# Altium project PC4-SODIMM_V200_RC_A1_20141015.PrjPcb (part 2 of 2)
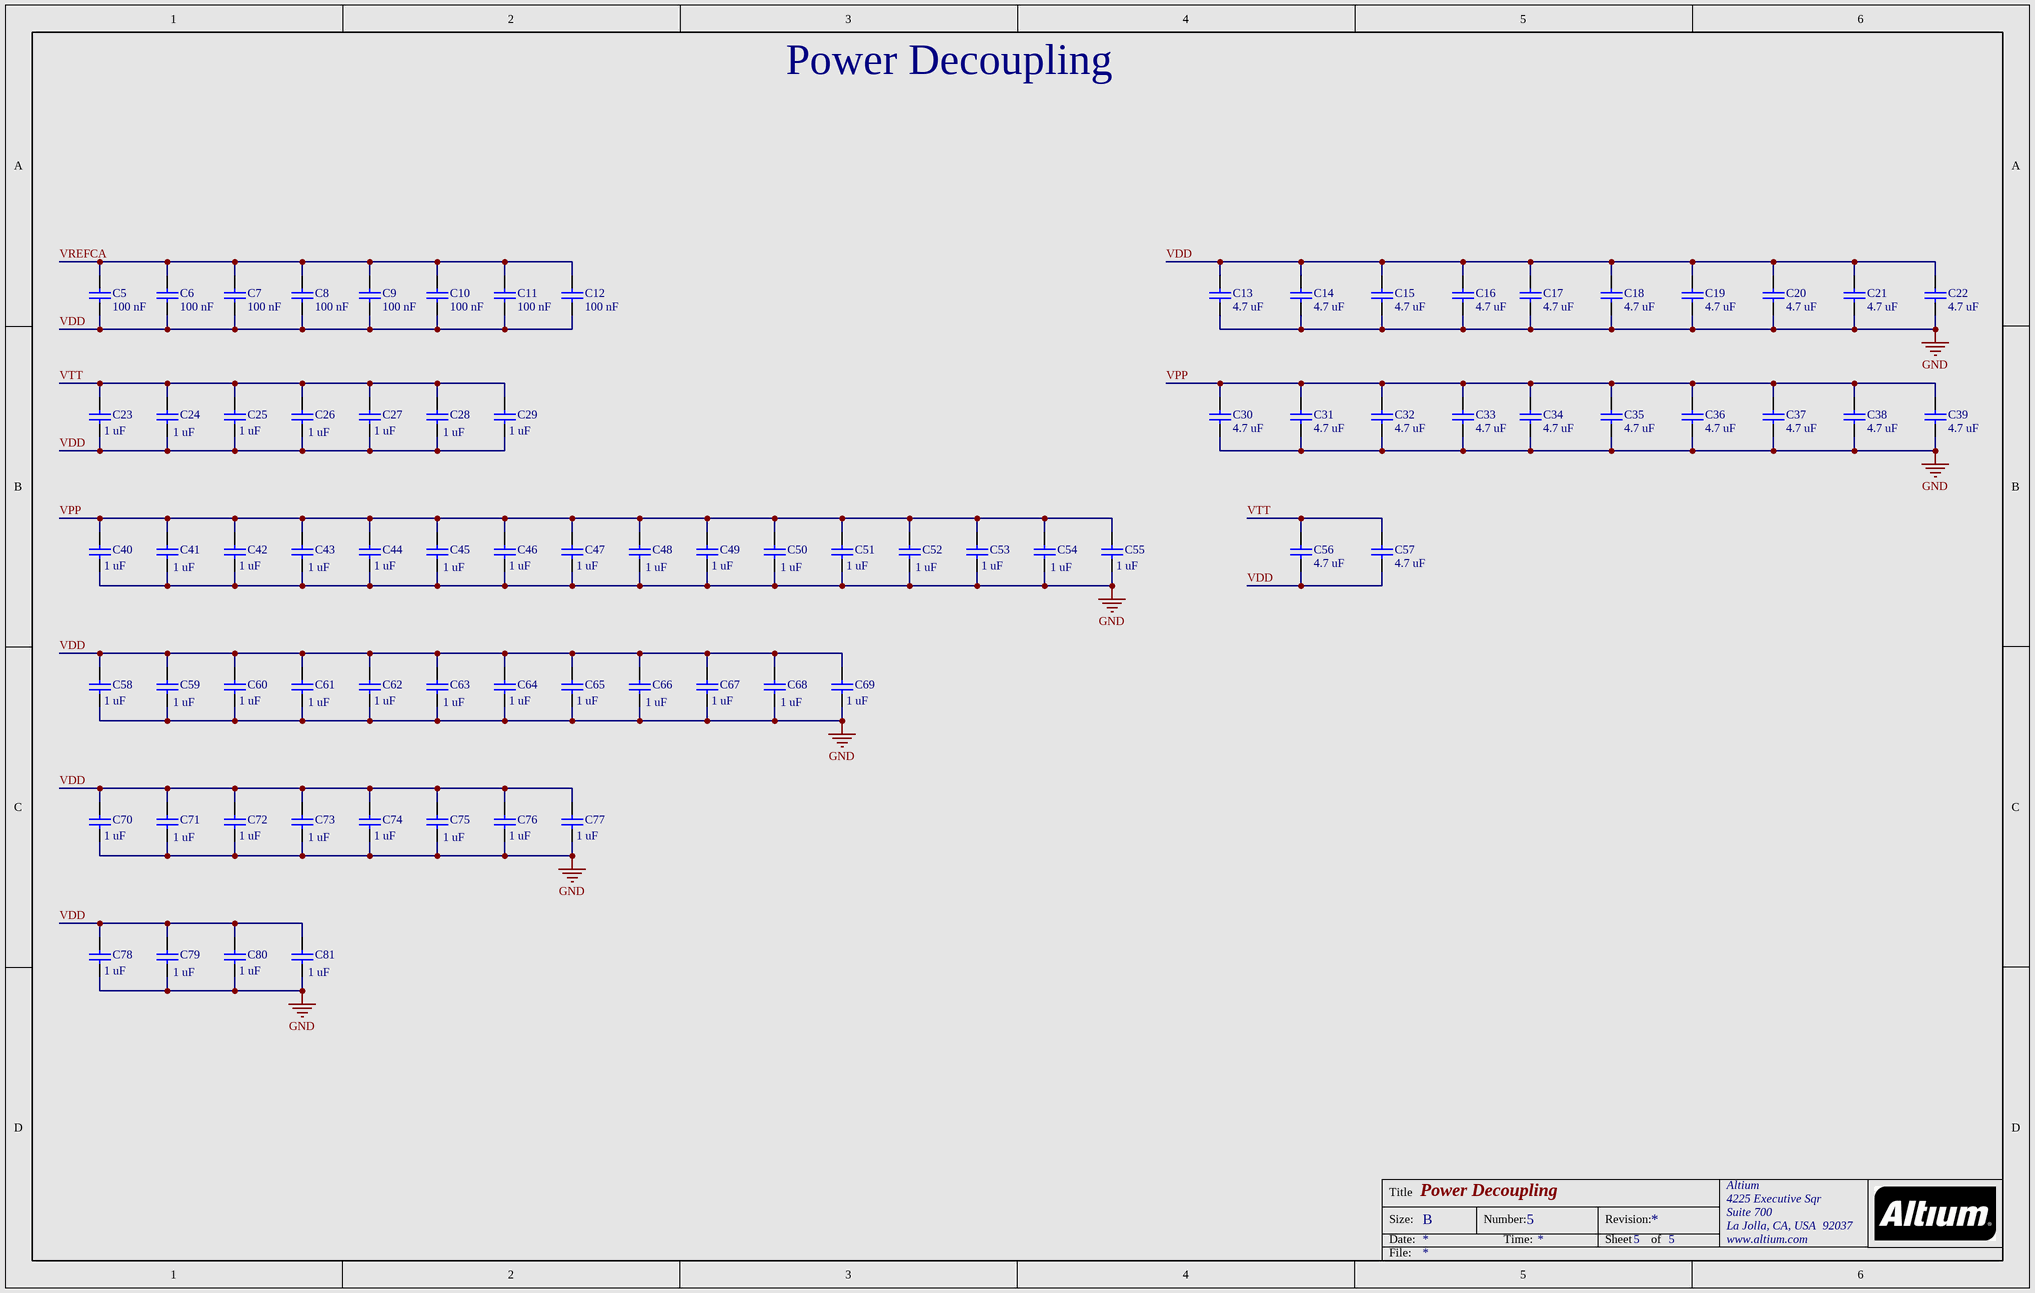
[diagram p5: Sheet5.SchDoc]

## Nets that join several sheets
GND: Sheet1 (98 pins), Sheet3 (60 pins), Sheet4 (60 pins), Sheet5 (60 pins)
A00: Sheet1 (X1.144), Sheet2 (RN5.3), Sheet3 (D2.L3 D3.L3 D4.L3 D5.L3), Sheet4 (U1.L3 U2.L3 U3.L3 U4.L3)
A01: Sheet1 (X1.133), Sheet2 (RN5.2), Sheet3 (D2.L7 D3.L7 D4.L7 D5.L7), Sheet4 (U1.L7 U2.L7 U3.L7 U4.L7)
A02: Sheet1 (X1.132), Sheet2 (RN7.1), Sheet3 (D2.M3 D3.M3 D4.M3 D5.M3), Sheet4 (U1.M3 U2.M3 U3.M3 U4.M3)
A03: Sheet1 (X1.131), Sheet2 (RN7.4), Sheet3 (D2.K7 D3.K7 D4.K7 D5.K7), Sheet4 (U1.K7 U2.K7 U3.K7 U4.K7)
A04: Sheet1 (X1.128), Sheet2 (RN5.1), Sheet3 (D2.K3 D3.K3 D4.K3 D5.K3), Sheet4 (U1.K3 U2.K3 U3.K3 U4.K3)
A05: Sheet1 (X1.126), Sheet2 (RN7.2), Sheet3 (D2.L8 D3.L8 D4.L8 D5.L8), Sheet4 (U1.L8 U2.L8 U3.L8 U4.L8)
A06: Sheet1 (X1.127), Sheet2 (RN2.4), Sheet3 (D2.L2 D3.L2 D4.L2 D5.L2), Sheet4 (U1.L2 U2.L2 U3.L2 U4.L2)
A07: Sheet1 (X1.122), Sheet2 (RN7.3), Sheet3 (D2.M8 D3.M8 D4.M8 D5.M8), Sheet4 (U1.M8 U2.M8 U3.M8 U4.M8)
A08: Sheet1 (X1.125), Sheet2 (RN5.4), Sheet3 (D2.M2 D3.M2 D4.M2 D5.M2), Sheet4 (U1.M2 U2.M2 U3.M2 U4.M2)
A09: Sheet1 (X1.121), Sheet2 (RN6.1), Sheet3 (D2.M7 D3.M7 D4.M7 D5.M7), Sheet4 (U1.M7 U2.M7 U3.M7 U4.M7)
A10: Sheet1 (X1.146), Sheet2 (RN3.1), Sheet3 (D2.J3 D3.J3 D4.J3 D5.J3), Sheet4 (U1.J3 U2.J3 U3.J3 U4.J3)
A11: Sheet1 (X1.120), Sheet2 (RN6.4), Sheet3 (D2.N2 D3.N2 D4.N2 D5.N2), Sheet4 (U1.N2 U2.N2 U3.N2 U4.N2)
A12: Sheet1 (X1.119), Sheet2 (RN4.3), Sheet3 (D2.J7 D3.J7 D4.J7 D5.J7), Sheet4 (U1.J7 U2.J7 U3.J7 U4.J7)
A13: Sheet1 (X1.158), Sheet2 (RN6.3), Sheet3 (D2.N8 D3.N8 D4.N8 D5.N8), Sheet4 (U1.N8 U2.N8 U3.N8 U4.N8)
A14: Sheet1 (X1.151), Sheet2 (RN2.3), Sheet3 (D2.H2 D3.H2 D4.H2 D5.H2), Sheet4 (U1.H2 U2.H2 U3.H2 U4.H2)
A15: Sheet1 (X1.156), Sheet2 (RN3.4), Sheet3 (D2.H7 D3.H7 D4.H7 D5.H7), Sheet4 (U1.H7 U2.H7 U3.H7 U4.H7)
A16: Sheet1 (X1.152), Sheet2 (RN4.2), Sheet3 (D2.H8 D3.H8 D4.H8 D5.H8), Sheet4 (U1.H8 U2.H8 U3.H8 U4.H8)
ACT: Sheet1 (X1.114), Sheet2 (RN3.3), Sheet3 (D2.H3 D3.H3 D4.H3 D5.H3), Sheet4 (U1.H3 U2.H3 U3.H3 U4.H3)
ALERT: Sheet1 (R2.1 X1.116), Sheet3 (D2.L9 D3.L9 D4.L9 D5.L9), Sheet4 (U1.L9 U2.L9 U3.L9 U4.L9)
BA0: Sheet1 (X1.150), Sheet2 (RN2.2), Sheet3 (D2.K2 D3.K2 D4.K2 D5.K2), Sheet4 (U1.K2 U2.K2 U3.K2 U4.K2)
BA1: Sheet1 (X1.145), Sheet2 (RN4.1), Sheet3 (D2.K8 D3.K8 D4.K8 D5.K8), Sheet4 (U1.K8 U2.K8 U3.K8 U4.K8)
BG0: Sheet1 (X1.115), Sheet2 (RN3.2), Sheet3 (D2.J2 D3.J2 D4.J2 D5.J2), Sheet4 (U1.J2 U2.J2 U3.J2 U4.J2)
BG1: Sheet1 (X1.113), Sheet2 (RN2.1), Sheet3 (D2.J8 D3.J8 D4.J8 D5.J8), Sheet4 (U1.J8 U2.J8 U3.J8 U4.J8)
CK0_N: Sheet1 (C3.2 X1.139), Sheet2 (R85.1), Sheet3 (D2.F8 D3.F8 D4.F8 D5.F8), Sheet4 (U1.F8 U2.F8 U3.F8 U4.F8)
CK0_P: Sheet1 (C3.1 X1.137), Sheet2 (R80.1), Sheet3 (D2.F7 D3.F7 D4.F7 D5.F7), Sheet4 (U1.F7 U2.F7 U3.F7 U4.F7)
CKE0: Sheet1 (X1.109), Sheet2 (RN1.4), Sheet3 (D2.G3 D3.G3 D4.G3 D5.G3), Sheet4 (U1.G3 U2.G3 U3.G3 U4.G3)
DM0: Sheet1 (X1.12), Sheet2 (R36.1)
DM0R: Sheet2 (R36.2), Sheet3 (D2.A7)
DM1: Sheet1 (X1.33), Sheet2 (R56.1)
DM1R: Sheet2 (R56.2), Sheet3 (D3.A7)
DM2: Sheet1 (X1.54), Sheet2 (R37.1)
DM2R: Sheet2 (R37.2), Sheet3 (D4.A7)
DM3: Sheet1 (X1.75), Sheet2 (R57.1)
DM3R: Sheet2 (R57.2), Sheet3 (D5.A7)
DM4: Sheet1 (X1.178), Sheet2 (R38.1)
DM4R: Sheet2 (R38.2), Sheet4 (U1.A7)
DM5: Sheet1 (X1.199), Sheet2 (R58.1)
DM5R: Sheet2 (R58.2), Sheet4 (U2.A7)
DM6: Sheet1 (X1.220), Sheet2 (R39.1)
DM6R: Sheet2 (R39.2), Sheet4 (U3.A7)
DM7: Sheet1 (X1.241), Sheet2 (R59.1)
DM7R: Sheet2 (R59.2), Sheet4 (U4.A7)
DQ00: Sheet1 (X1.8), Sheet2 (R32.1)
DQ00R: Sheet2 (R32.2), Sheet3 (D2.B7)
DQ01: Sheet1 (X1.7), Sheet2 (R8.1)
DQ01R: Sheet2 (R8.2), Sheet3 (D2.D7)
DQ02: Sheet1 (X1.20), Sheet2 (R44.1)
DQ02R: Sheet2 (R44.2), Sheet3 (D2.D3)
DQ03: Sheet1 (X1.21), Sheet2 (R24.1)
DQ03R: Sheet2 (R24.2), Sheet3 (D2.C2)
DQ04: Sheet1 (X1.4), Sheet2 (R28.1)
DQ04R: Sheet2 (R28.2), Sheet3 (D2.D8)
DQ05: Sheet1 (X1.3), Sheet2 (R4.1)
DQ05R: Sheet2 (R4.2), Sheet3 (D2.E7)
DQ06: Sheet1 (X1.16), Sheet2 (R40.1)
DQ06R: Sheet2 (R40.2), Sheet3 (D2.D2)
DQ07: Sheet1 (X1.17), Sheet2 (R20.1)
DQ07R: Sheet2 (R20.2), Sheet3 (D2.E3)
DQ08: Sheet1 (X1.28), Sheet2 (R72.1)
DQ08R: Sheet2 (R72.2), Sheet3 (D3.E3)
DQ09: Sheet1 (X1.29), Sheet2 (R52.1)
DQ09R: Sheet2 (R52.2), Sheet3 (D3.D2)
DQ10: Sheet1 (X1.41), Sheet2 (R64.1)
DQ10R: Sheet2 (R64.2), Sheet3 (D3.D8)
DQ11: Sheet1 (X1.42), Sheet2 (R90.1)
DQ11R: Sheet2 (R90.2), Sheet3 (D3.E7)
DQ12: Sheet1 (X1.24), Sheet2 (R68.1)
DQ12R: Sheet2 (R68.2), Sheet3 (D3.C2)
DQ13: Sheet1 (X1.25), Sheet2 (R48.1)
DQ13R: Sheet2 (R48.2), Sheet3 (D3.D3)
DQ14: Sheet1 (X1.38), Sheet2 (R86.1)
DQ14R: Sheet2 (R86.2), Sheet3 (D3.D7)
DQ15: Sheet1 (X1.37), Sheet2 (R60.1)
DQ15R: Sheet2 (R60.2), Sheet3 (D3.B7)
DQ16: Sheet1 (X1.50), Sheet2 (R33.1)
DQ16R: Sheet2 (R33.2), Sheet3 (D4.D7)
DQ17: Sheet1 (X1.49), Sheet2 (R9.1)
DQ17R: Sheet2 (R9.2), Sheet3 (D4.B7)
DQ18: Sheet1 (X1.62), Sheet2 (R45.1)
DQ18R: Sheet2 (R45.2), Sheet3 (D4.D3)
DQ19: Sheet1 (X1.63), Sheet2 (R25.1)
DQ19R: Sheet2 (R25.2), Sheet3 (D4.C2)
DQ20: Sheet1 (X1.46), Sheet2 (R29.1)
DQ20R: Sheet2 (R29.2), Sheet3 (D4.E7)
DQ21: Sheet1 (X1.45), Sheet2 (R5.1)
DQ21R: Sheet2 (R5.2), Sheet3 (D4.D8)
DQ22: Sheet1 (X1.58), Sheet2 (R41.1)
DQ22R: Sheet2 (R41.2), Sheet3 (D4.D2)
DQ23: Sheet1 (X1.59), Sheet2 (R21.1)
DQ23R: Sheet2 (R21.2), Sheet3 (D4.E3)
DQ24: Sheet1 (X1.70), Sheet2 (R73.1)
DQ24R: Sheet2 (R73.2), Sheet3 (D5.D2)
DQ25: Sheet1 (X1.71), Sheet2 (R53.1)
DQ25R: Sheet2 (R53.2), Sheet3 (D5.E3)
DQ26: Sheet1 (X1.83), Sheet2 (R65.1)
DQ26R: Sheet2 (R65.2), Sheet3 (D5.D8)
DQ27: Sheet1 (X1.84), Sheet2 (R91.1)
DQ27R: Sheet2 (R91.2), Sheet3 (D5.E7)
DQ28: Sheet1 (X1.66), Sheet2 (R69.1)
DQ28R: Sheet2 (R69.2), Sheet3 (D5.D3)
DQ29: Sheet1 (X1.67), Sheet2 (R49.1)
DQ29R: Sheet2 (R49.2), Sheet3 (D5.C2)
DQ30: Sheet1 (X1.79), Sheet2 (R61.1)
DQ30R: Sheet2 (R61.2), Sheet3 (D5.B7)
DQ31: Sheet1 (X1.80), Sheet2 (R87.1)
DQ31R: Sheet2 (R87.2), Sheet3 (D5.D7)
DQ32: Sheet1 (X1.174), Sheet2 (R34.1)
DQ32R: Sheet2 (R34.2), Sheet4 (U1.D8)
DQ33: Sheet1 (X1.173), Sheet2 (R10.1)
DQ33R: Sheet2 (R10.2), Sheet4 (U1.E7)
DQ34: Sheet1 (X1.187), Sheet2 (R26.1)
DQ34R: Sheet2 (R26.2), Sheet4 (U1.E3)
DQ35: Sheet1 (X1.186), Sheet2 (R46.1)
DQ35R: Sheet2 (R46.2), Sheet4 (U1.D2)
DQ36: Sheet1 (X1.170), Sheet2 (R30.1)
DQ36R: Sheet2 (R30.2), Sheet4 (U1.B7)
DQ37: Sheet1 (X1.169), Sheet2 (R6.1)
DQ37R: Sheet2 (R6.2), Sheet4 (U1.D7)
DQ38: Sheet1 (X1.183), Sheet2 (R22.1)
DQ38R: Sheet2 (R22.2), Sheet4 (U1.C2)
DQ39: Sheet1 (X1.182), Sheet2 (R42.1)
DQ39R: Sheet2 (R42.2), Sheet4 (U1.D3)
DQ40: Sheet1 (X1.195), Sheet2 (R54.1)
DQ40R: Sheet2 (R54.2), Sheet4 (U2.C2)
DQ41: Sheet1 (X1.194), Sheet2 (R74.1)
DQ41R: Sheet2 (R74.2), Sheet4 (U2.D3)
DQ42: Sheet1 (X1.207), Sheet2 (R66.1)
DQ42R: Sheet2 (R66.2), Sheet4 (U2.B7)
DQ43: Sheet1 (X1.208), Sheet2 (R92.1)
DQ43R: Sheet2 (R92.2), Sheet4 (U2.D7)
DQ44: Sheet1 (X1.191), Sheet2 (R50.1)
DQ44R: Sheet2 (R50.2), Sheet4 (U2.D2)
DQ45: Sheet1 (X1.190), Sheet2 (R70.1)
DQ45R: Sheet2 (R70.2), Sheet4 (U2.E3)
DQ46: Sheet1 (X1.203), Sheet2 (R62.1)
DQ46R: Sheet2 (R62.2), Sheet4 (U2.E7)
DQ47: Sheet1 (X1.204), Sheet2 (R88.1)
DQ47R: Sheet2 (R88.2), Sheet4 (U2.D8)
DQ48: Sheet1 (X1.216), Sheet2 (R35.1)
DQ48R: Sheet2 (R35.2), Sheet4 (U3.E7)
DQ49: Sheet1 (X1.215), Sheet2 (R11.1)
DQ49R: Sheet2 (R11.2), Sheet4 (U3.D8)
DQ50: Sheet1 (X1.228), Sheet2 (R47.1)
DQ50R: Sheet2 (R47.2), Sheet4 (U3.D2)
DQ51: Sheet1 (X1.229), Sheet2 (R27.1)
DQ51R: Sheet2 (R27.2), Sheet4 (U3.E3)
DQ52: Sheet1 (X1.211), Sheet2 (R7.1)
DQ52R: Sheet2 (R7.2), Sheet4 (U3.B7)
DQ53: Sheet1 (X1.212), Sheet2 (R31.1)
DQ53R: Sheet2 (R31.2), Sheet4 (U3.D7)
DQ54: Sheet1 (X1.224), Sheet2 (R43.1)
DQ54R: Sheet2 (R43.2), Sheet4 (U3.D3)
DQ55: Sheet1 (X1.225), Sheet2 (R23.1)
DQ55R: Sheet2 (R23.2), Sheet4 (U3.C2)
DQ56: Sheet1 (X1.237), Sheet2 (R55.1)
DQ56R: Sheet2 (R55.2), Sheet4 (U4.C2)
DQ57: Sheet1 (X1.236), Sheet2 (R75.1)
DQ57R: Sheet2 (R75.2), Sheet4 (U4.D3)
DQ58: Sheet1 (X1.249), Sheet2 (R67.1)
DQ58R: Sheet2 (R67.2), Sheet4 (U4.B7)
DQ59: Sheet1 (X1.250), Sheet2 (R93.1)
DQ59R: Sheet2 (R93.2), Sheet4 (U4.D7)
DQ60: Sheet1 (X1.232), Sheet2 (R71.1)
DQ60R: Sheet2 (R71.2), Sheet4 (U4.E3)
DQ61: Sheet1 (X1.233), Sheet2 (R51.1)
DQ61R: Sheet2 (R51.2), Sheet4 (U4.D2)
DQ62: Sheet1 (X1.245), Sheet2 (R63.1)
DQ62R: Sheet2 (R63.2), Sheet4 (U4.D8)
DQ63: Sheet1 (X1.246), Sheet2 (R89.1)
DQ63R: Sheet2 (R89.2), Sheet4 (U4.E7)
DQS0_N: Sheet1 (X1.11), Sheet2 (R12.1)
DQS0_P: Sheet1 (X1.13), Sheet2 (R16.1)
DQS0R_N: Sheet2 (R12.2), Sheet3 (D2.B3)
DQS0R_P: Sheet2 (R16.2), Sheet3 (D2.C3)
DQS1_N: Sheet1 (X1.32), Sheet2 (R76.1)
DQS1_P: Sheet1 (X1.34), Sheet2 (R81.1)
DQS1R_N: Sheet2 (R76.2), Sheet3 (D3.B3)
DQS1R_P: Sheet2 (R81.2), Sheet3 (D3.C3)
DQS2_N: Sheet1 (X1.53), Sheet2 (R13.1)
DQS2_P: Sheet1 (X1.55), Sheet2 (R17.1)
DQS2R_N: Sheet2 (R13.2), Sheet3 (D4.B3)
DQS2R_P: Sheet2 (R17.2), Sheet3 (D4.C3)
DQS3_N: Sheet1 (X1.74), Sheet2 (R77.1)
DQS3_P: Sheet1 (X1.76), Sheet2 (R82.1)
DQS3R_N: Sheet2 (R77.2), Sheet3 (D5.B3)
DQS3R_P: Sheet2 (R82.2), Sheet3 (D5.C3)
DQS4_N: Sheet1 (X1.177), Sheet2 (R14.1)
DQS4_P: Sheet1 (X1.179), Sheet2 (R18.1)
DQS4R_N: Sheet2 (R14.2), Sheet4 (U1.B3)
DQS4R_P: Sheet2 (R18.2), Sheet4 (U1.C3)
DQS5_N: Sheet1 (X1.198), Sheet2 (R78.1)
DQS5_P: Sheet1 (X1.200), Sheet2 (R83.1)
DQS5R_N: Sheet2 (R78.2), Sheet4 (U2.B3)
DQS5R_P: Sheet2 (R83.2), Sheet4 (U2.C3)
DQS6_N: Sheet1 (X1.219), Sheet2 (R15.1)
DQS6_P: Sheet1 (X1.221), Sheet2 (R19.1)
DQS6R_N: Sheet2 (R15.2), Sheet4 (U3.B3)
DQS6R_P: Sheet2 (R19.2), Sheet4 (U3.C3)
DQS7_N: Sheet1 (X1.240), Sheet2 (R79.1)
DQS7_P: Sheet1 (X1.242), Sheet2 (R84.1)
DQS7R_N: Sheet2 (R79.2), Sheet4 (U4.B3)
DQS7R_P: Sheet2 (R84.2), Sheet4 (U4.C3)
MEMRST: Sheet1 (C1.1 R1.2), Sheet3 (D2.L1 D3.L1 D4.L1 D5.L1), Sheet4 (U1.L1 U2.L1 U3.L1 U4.L1)
ODT0: Sheet1 (X1.155), Sheet2 (RN1.2), Sheet3 (D2.F3 D3.F3 D4.F3 D5.F3), Sheet4 (U1.F3 U2.F3 U3.F3 U4.F3)
PARITY: Sheet1 (X1.143), Sheet2 (RN6.2), Sheet3 (D2.N3 D3.N3 D4.N3 D5.N3), Sheet4 (U1.N3 U2.N3 U3.N3 U4.N3)
S0: Sheet1 (X1.149), Sheet2 (RN1.1), Sheet3 (D2.G7 D3.G7 D4.G7 D5.G7), Sheet4 (U1.G7 U2.G7 U3.G7 U4.G7)
VDD: Sheet1 (20 pins), Sheet2 (C4.2), Sheet3 (56 pins), Sheet4 (56 pins), Sheet5 (51 pins)
VPP: Sheet1 (X1.257 X1.259), Sheet3 (8 pins), Sheet4 (8 pins), Sheet5 (26 pins)
VREFCA: Sheet1 (X1.164), Sheet3 (D2.J1 D3.J1 D4.J1 D5.J1), Sheet4 (U1.J1 U2.J1 U3.J1 U4.J1), Sheet5 (8 pins)
VTT: Sheet1 (X1.258), Sheet2 (28 pins), Sheet5 (9 pins)